# Altium schematic sheet Flash.SchDoc: MoonPilot - Flash
size A3; DrawnBy: Máni Magnússon; Revision: A; SheetNumber: 9
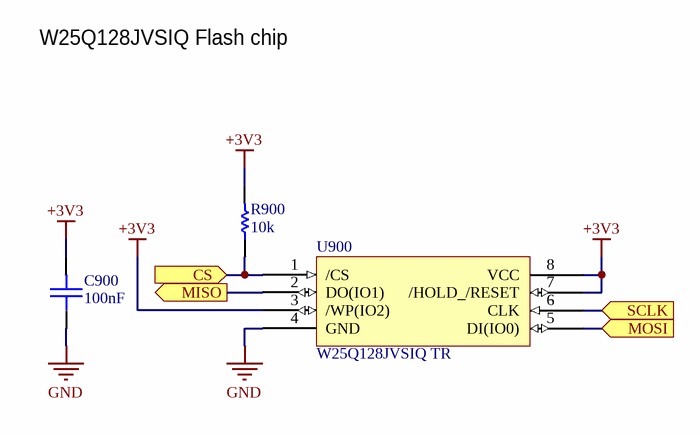
[diagram p0: Flash.SchDoc]

## Parts
C900  100nF  [0603_CAP]
R900  10k  [0603_RES]
U900  W25Q128JVSIQ TR  [SOIC_208MIL_WIN]

## Ports
CS (in), MISO (out), MOSI (in), SCLK (in)

## Nets
+3V3: C900.1 R900.2 U900.3(/WP(IO2)) U900.7(/HOLD_/RESET) U900.8(VCC)
GND: C900.2 U900.4(GND)
CS: R900.1 U900.1(/CS) ; port CS
MISO: U900.2(DO(IO1)) ; port MISO
MOSI: U900.5(DI(IO0)) ; port MOSI
SCLK: U900.6(CLK) ; port SCLK

## Notes on the sheet
- W25Q128JVSIQ Flash chip
- Sheet title:
- Revision:
- Drawn by:
- Date:
- File:

## Library data of the parts
C900 = Capacitor
R900 = Resistor
U900 = W25Q128JVSIQ TR: No Description Available; Vendor: Winbond; Built_By: EMA_Cory; SourceLibrary: Winbond_2020-02-06; Datasheet: https://www.winbond.com/resource-files/w25q128jv%20revf%2003272018%20plus.pdf; Manufacturer_Part_Number: W25Q128JVSIQ TR; Copyright: Copyright (C) 2018 Accelerated Designs. All rights reserved; RefDes: RefDes; Type: DEV